# EAGLE design Solarbrain (EAGLE 6.2)
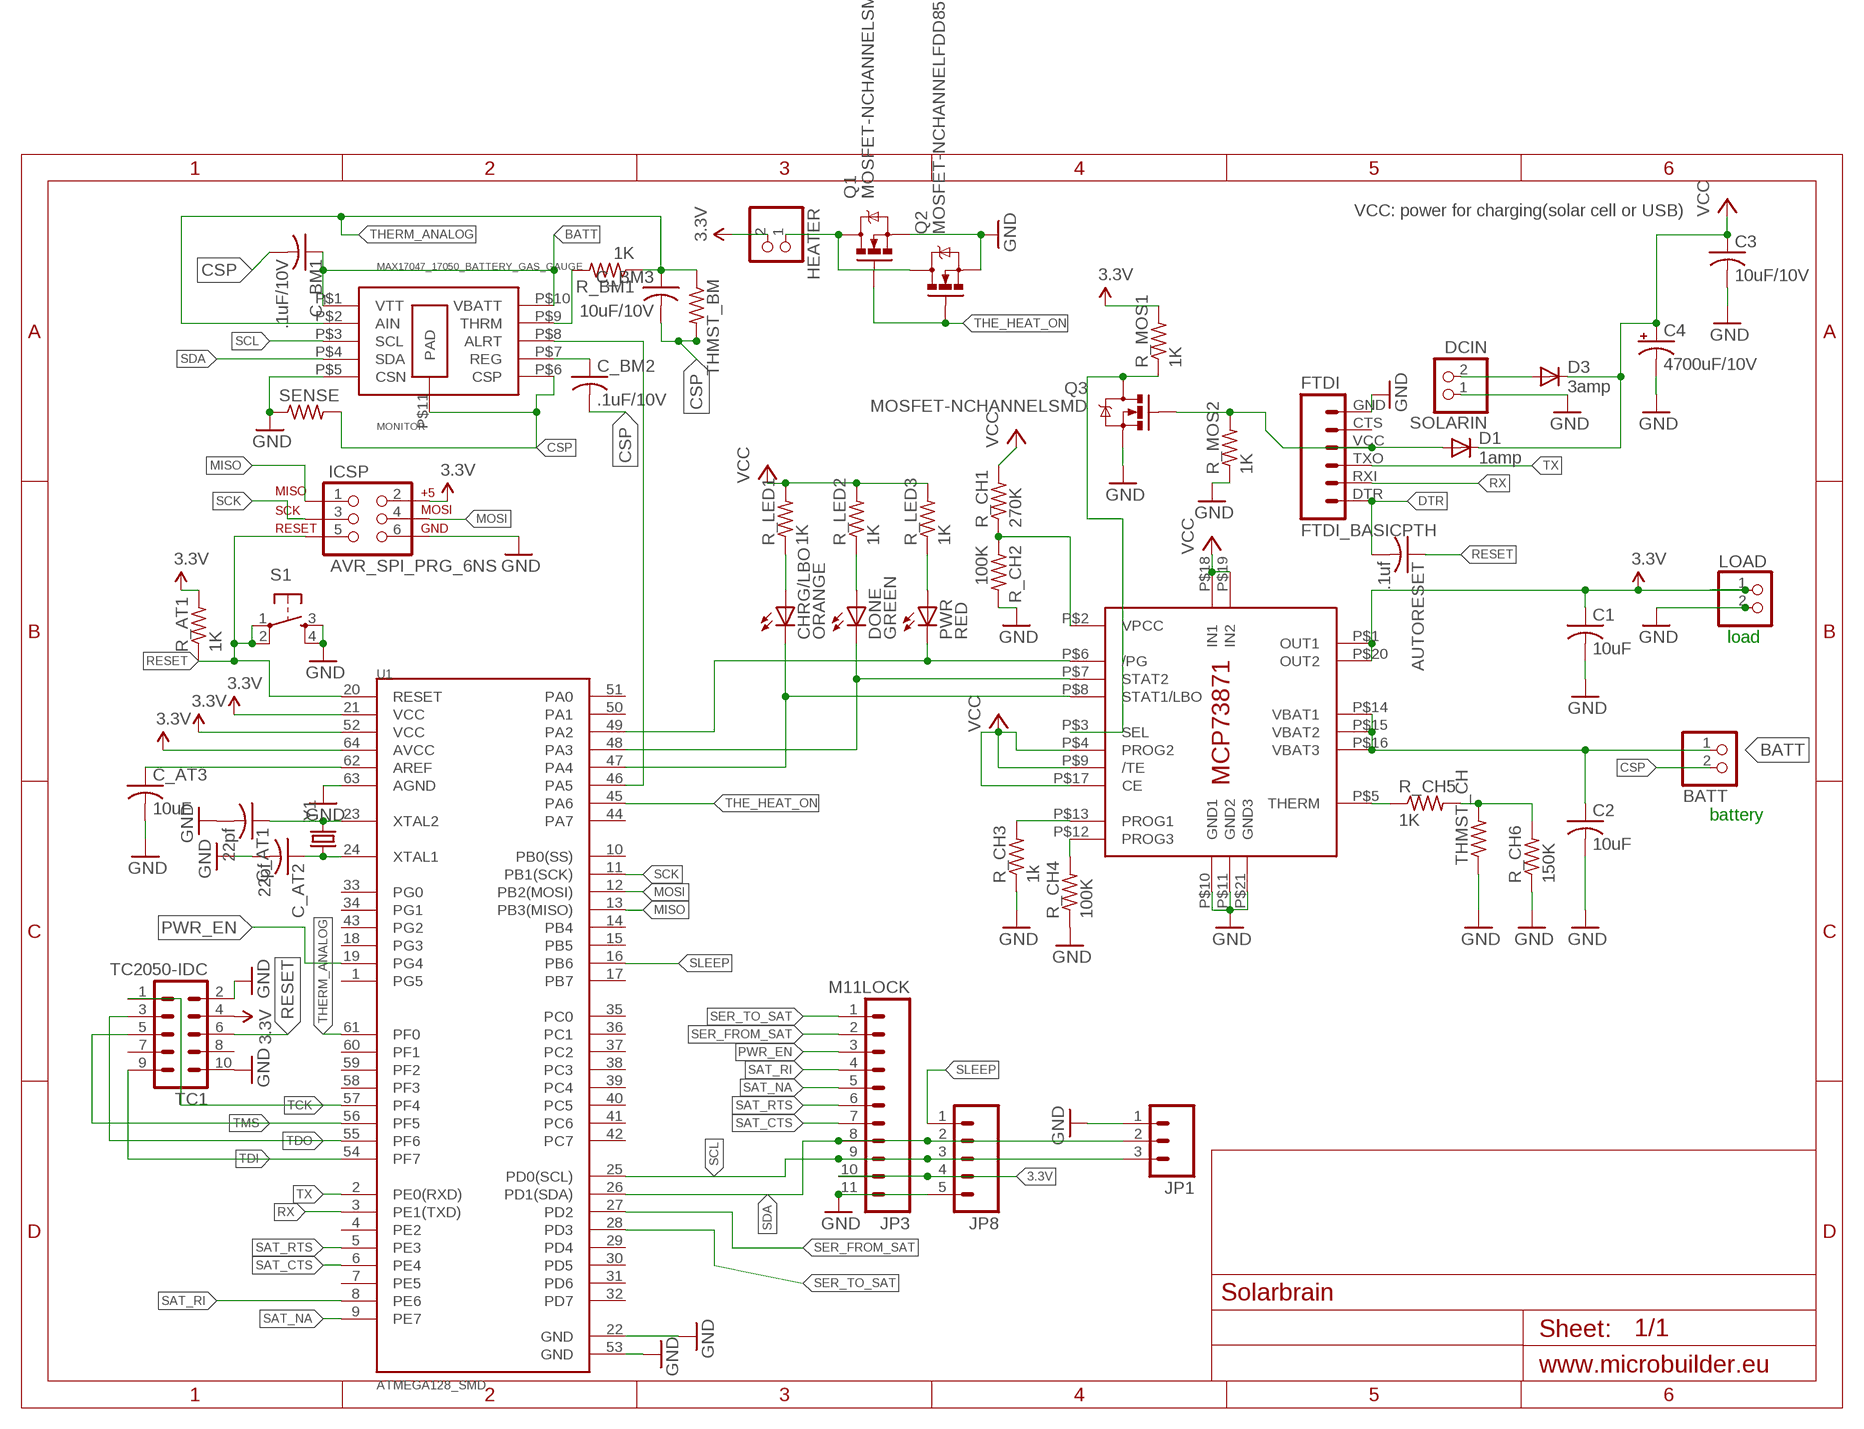
[diagram p0: schematic, sheet 1]

## Parts
AUTORESET  .1uf  C-USC0603  [C0603]
BATT  JST_2PIN-SMT-RA  [JST-PH-2-SMT-RA]
C1  10uF  C-USC0603  [C0603]
C2  10uF  C-USC0805K  [C0805K]
C3  10uF/10V  C-USC0603  [C0603]
C4  4700uF/10V  CPOL-USG  [PANASONIC_G]
C_AT1  22pf  C-USC0603K  [C0603K]
C_AT2  22pf  C-USC0603  [C0603]
C_AT3  10uF  C-USC0805K  [C0805K]
C_BM1  .1uF/10V  C-USC0603  [C0603]
C_BM2  .1uF/10V  C-USC0603  [C0603]
C_BM3  10uF/10V  C-USC0603  [C0603]
CHRG/LBO  ORANGE  LEDCHIP-LED0603  [CHIP-LED0603]
D1  1amp  DIODESMA  [SMA-DIODE]
D3  3amp  DIODESMA  [SMA-DIODE]
DONE  GREEN  LEDCHIP-LED0603  [CHIP-LED0603]
FTDI  FTDI_BASICPTH  [FTDI_BASIC]
HEATER  HEADER-1X2ROUND  [1X02_ROUND]
IC1  MCP73871  [QFN20_4MM]
ICSP  AVR_SPI_PRG_6NS  [2X3-NS]
JP1  M03PTH  [1X03]
JP3  M11LOCK  [1X11_LOCK]
JP8  M05LOCK  [1X05_LOCK]
LOAD  HEADER-1X2ROUND  [1X02_ROUND]
MONITOR  MAX17047_17050_BATTERY_GAS_GAUGE  [TDFN_10_3X3MM]
PWR  RED  LEDCHIP-LED0603  [CHIP-LED0603]
Q1  MOSFET-NCHANNELSMD  [SOT23-3]
Q2  MOSFET-NCHANNELFDD8580  [DPAK]
Q3  MOSFET-NCHANNELSMD  [SOT23-3]
R_AT1  1K  R-US_R0603  [R0603]
R_BM1  1K  R-US_R0603  [R0603]
R_CH1  270K  R-US_R0603  [R0603]
R_CH2  100K  R-US_R0603  [R0603]
R_CH3  1k  R-US_R0603  [R0603]
R_CH4  100K  R-US_R0603  [R0603]
R_CH5  1K  R-US_R0603  [R0603]
R_CH6  150K  R-US_R0603  [R0603]
R_LED1  1K  R-US_R0603  [R0603]
R_LED2  1K  R-US_R0603  [R0603]
R_LED3  1K  R-US_R0603  [R0603]
R_MOS1  1K  R-US_R0603  [R0603]
R_MOS2  1K  R-US_R0603  [R0603]
S1  TAC_SWITCHSMD  [TACTILE_SWITCH_SMD]
SENSE  R-US_R3225  [R3225]
SOLARIN  DCIN  HEADER-1X2ROUND  [1X02_ROUND]
TC1  TC2050-IDC  [TC2050-IDC]
THMST_BM  R-US_R0603  [R0603]
THMST_CH  R-US_R0603  [R0603]
U1  ATMEGA128_SMD  [TQFP64]
Y1  CRYSTAL5X3  [CRYSTAL-SMD-5X3]

## Nets
3.3V [power]: C1.1 HEATER.2 IC1.P$1(OUT1) IC1.P$20(OUT2) ICSP.2 JP3.10 JP8.4 LOAD.1 R_AT1.2 R_MOS1.2 TC1.4 U1.21(VCC) U1.52(VCC) U1.64(AVCC)
#PG: IC1.P$6(/PG) PWR.C U1.49(PA2)
BATT [power]: BATT.1 C2.1 C_BM1.1 IC1.P$14(VBAT1) IC1.P$15(VBAT2) IC1.P$16(VBAT3) MONITOR.P$1(VTT) MONITOR.P$10(VBATT)
CSP [power]: BATT.2 C_BM1.2 C_BM2.2 C_BM3.2 MONITOR.P$6(CSP) MONITOR.P$11(PAD) SENSE.2 THMST_BM.2
DTR [power]: AUTORESET.2 FTDI.DTR
GND [power]: C1.2 C2.2 C3.2 C4.- C_AT1.2 C_AT2.2 C_AT3.2 FTDI.GND IC1.P$10(GND1) IC1.P$11(GND2) IC1.P$21(GND3) ICSP.6 JP1.1 JP3.11 JP8.5 LOAD.2 MONITOR.P$5(CSN) Q1.2(S) Q2.3(S) Q3.2(S) R_CH2.2 R_CH3.1 R_CH4.1 R_CH6.1 R_MOS2.1 S1.3 S1.4 SENSE.1 SOLARIN.1 TC1.2 TC1.10 THMST_CH.1 U1.22(GND) U1.53(GND) U1.63(AGND)
MISO [power]: ICSP.1 U1.13(PB3(MISO))
MOSI [power]: ICSP.4 U1.12(PB2(MOSI))
N$2 [power]: D1.A FTDI.VCC Q3.1(G) R_MOS2.2
N$3 [power]: C_AT1.1 U1.23(XTAL2) Y1.3
N$5: IC1.P$5(THERM) R_CH5.1
N$8: R_CH5.2 R_CH6.2 THMST_CH.2
N$9 [power]: C_AT2.1 U1.24(XTAL1) Y1.1
N$12: CHRG/LBO.A R_LED1.1
N$13: DONE.A R_LED2.1
N$14: PWR.A R_LED3.1
N$19 [power]: MONITOR.P$8(ALRT) U1.46(PA5)
N$20 [power]: C_AT3.1 U1.62(AREF)
N$21 [power]: HEATER.1 Q1.3(D) Q2.4(D)
N$22 [power]: MONITOR.P$9(THRM) R_BM1.2
N$24 [power]: D3.A SOLARIN.2
N$26 [power]: C_BM2.1 MONITOR.P$7(REG)
PROG1: IC1.P$13(PROG1) R_CH3.2
PROG3: IC1.P$12(PROG3) R_CH4.2
PWR_EN: JP3.3 U1.19(PG4)
RESET [power]: AUTORESET.1 ICSP.5 R_AT1.1 S1.1 S1.2 TC1.6 U1.20(RESET)
RX [power]: FTDI.RXI U1.3(PE1(TXD))
SAT_CTS: JP3.7 U1.6(PE4)
SAT_NA [power]: JP3.5 U1.9(PE7)
SAT_RI [power]: JP3.4 U1.8(PE6)
SAT_RTS [power]: JP3.6 U1.5(PE3)
SCK [power]: ICSP.3 U1.11(PB1(SCK))
SCL [power]: JP1.3 JP3.9 JP8.3 MONITOR.P$3(SCL) U1.25(PD0(SCL))
SDA [power]: JP1.2 JP3.8 JP8.2 MONITOR.P$4(SDA) U1.26(PD1(SDA))
SEL [power]: IC1.P$3(SEL) Q3.3(D) R_MOS1.1
SER_FROM_SAT: JP3.2 U1.27(PD2)
SER_TO_SAT: JP3.1 U1.28(PD3)
SLEEP: JP8.1 U1.16(PB6)
STAT1: CHRG/LBO.C IC1.P$8(STAT1/LBO) U1.47(PA4)
STAT2: DONE.C IC1.P$7(STAT2) U1.48(PA3)
TCK [power]: TC1.1 U1.57(PF4)
TDI [power]: TC1.9 U1.54(PF7)
TDO [power]: TC1.3 U1.55(PF6)
THE_HEAT_ON [power]: Q1.1(G) Q2.1(G) U1.45(PA6)
THERM_ANALOG [power]: C_BM3.1 MONITOR.P$2(AIN) R_BM1.1 THMST_BM.1 U1.61(PF0)
TMS [power]: TC1.5 U1.56(PF5)
TX [power]: FTDI.TXO U1.2(PE0(RXD))
VCC [power]: C3.1 C4.+ D1.C D3.C IC1.P$4(PROG2) IC1.P$9(/TE) IC1.P$17(CE) IC1.P$18(IN1) IC1.P$19(IN2) R_CH1.2 R_LED1.2 R_LED2.2 R_LED3.2
VPCC: IC1.P$2(VPCC) R_CH1.1 R_CH2.1
Unconnected: FTDI.CTS TC1.7 TC1.8 U1.1(PG5) U1.4(PE2) U1.7(PE5) U1.10(PB0(SS)) U1.14(PB4) U1.15(PB5) U1.17(PB7) U1.18(PG3) U1.29(PD4) U1.30(PD5) U1.31(PD6) U1.32(PD7) U1.33(PG0) U1.34(PG1) U1.35(PC0) U1.36(PC1) U1.37(PC2) U1.38(PC3) U1.39(PC4) U1.40(PC5) U1.41(PC6) U1.42(PC7) U1.43(PG2) U1.44(PA7) U1.50(PA1) U1.51(PA0) U1.58(PF3) U1.59(PF2) U1.60(PF1)

## Notes on the sheet
- VCC: power for charging(solar cell or USB)
- load
- battery

## Library data of the parts
AUTORESET C1-C3 C_AT1-C_AT3 C_BM1-C_BM3 = adafruit:C-US: CAPACITOR, American symbol
BATT = adafruit:JST_2PIN: JST 2-Pin Connectors of various flavors SMT-RA (S2B-PH-SM4) 4UConnector #17311 SMT (B2B-PH-SM4) THM-RA (S2B-PH) THM (B2B-PH)
C4 = adafruit:CPOL-US: POLARIZED CAPACITOR, American symbol
CHRG/LBO DONE PWR = adafruit:LED: LED OSRAM: - CHIPLED LG R971, LG N971, LY N971, LG Q971, LY Q971, LO R971, LY R971 LH N974, LH R974 LS Q976, LO Q976, LY Q976 LO Q996 - Hyper CHIPLED LW Q18S LB Q993, LB Q99A, LB R99A - SideLED LS A670, LO A670, LY A670, LG A670, LP A670 LB A673, LV A673, LT A673, LW A673 LH A674 LY A675 LS A676, LA A676, LO A676, LY A676, LW A676 LS A679, LY A679, LG A679 - Hyper Micro SIDELED® LS Y876, LA Y876, LO Y876, LY Y876 LT Y87S - SmartLED LW L88C, LW L88S LB L89C, LB L89S, LG L890 LS L89K, LO L89K, LY L89K LS L896, LA L896, LO L896, LY L896 - TOPLED LS T670, LO T670, LY T670, LG T670, LP T670 LSG T670, LSP T670, LSY T670, LOP T670, LYG T670 LG T671, LOG T671, LSG T671 LB T673, LV T673, LT T673, LW T673 LH T674 LS T676, LA T676, LO T676, LY T676, LB T676, LH T676, LSB T676, LW T676 LB T67C, LV T67C, LT T67C, LS T67K, LO T67K, LY T67K, LW E67C LS E67B, LA E67B, LO E67B, LY E67B, LB E67C, LV E67C, LT E67C LW T67C LS T679, LY T679, LG T679 LS T770, LO T770, LY T770, LG T770, LP T770 LB T773, LV T773, LT T773, LW T773 LH T774 LS E675, LA E675, LY E675, LS T675 LS T776, LA T776, LO T776, LY T776, LB T776 LHGB T686 LT T68C, LB T68C - Hyper Mini TOPLED® LB M676 - Mini TOPLED Santana® LG M470 LS M47K, LO M47K, LY M47K Source: http://www.osram.convergy.de/
D1 D3 = SparkFun2011:DIODE: Diode These are standard reverse protection diodes and small signal diodes. SMA package can handle up to about 1A. SOD-323 can handle about 200mA. What the SOD-323 package when ordering, there are some mfgs out there that are 5-pin packages.
FTDI = SparkFun2011:FTDI_BASIC: FTDI Basic: 3.3V and 5V
HEATER LOAD SOLARIN = microbuilder:HEADER-1X2: PIN HEADER
IC1 = adafruit:MCP73871
ICSP = SparkFun2011:AVR_SPI_PRG_6: AVR ISP 6 Pin This is the reduced ISP connector for AVR programming. Common on Arduino. This footprint will take up less PCB space and can be used with a 10-pin to 6-pin adapter such as SKU: BOB-08508
JP1 = SparkFun2011:M03: Header 3 Standard 3-pin 0.1" header. Use with straight break away headers (SKU : PRT-00116), right angle break away headers (PRT-00553), swiss pins (PRT-00743), machine pins (PRT-00117), and female headers (PRT-00115). Molex polarized connector foot print use with SKU : PRT-08232 with associated crimp pins and housings.
JP3 = SparkFun2011:M11: Header 11 Standard 11-pin 0.1" header. Use with straight break away headers (SKU : PRT-00116), right angle break away headers (PRT-00553), swiss pins (PRT-00743), machine pins (PRT-00117), and female headers (PRT-00115).
JP8 = SparkFun2011:M05: Header 5 Standard 5-pin 0.1" header. Use with straight break away headers (SKU : PRT-00116), right angle break away headers (PRT-00553), swiss pins (PRT-00743), machine pins (PRT-00117), and female headers (PRT-00115). Molex polarized connector foot print use with SKU : PRT-08230 with associated crimp pins and housings.
MONITOR = RaphaelBigLibrary:MAX17047_17050_BATTERY_GAS_GAUGE
Q1-Q3 = SparkFun2011:MOSFET-NCHANNEL
R_AT1 R_BM1 R_CH1-R_CH6 R_LED1-R_LED3 R_MOS1 R_MOS2 = adafruit:R-US_: RESISTOR, American symbol
S1 = SparkFun2011:TAC_SWITCH: Momentary Switch Button commonly used for reset or general input. Spark Fun Electronics SKU : COM-00097
SENSE THMST_BM THMST_CH = rcl:R-US_: RESISTOR, American symbol
TC1 = TagConnect:TC2050-IDC: Tag-Connect In Circuit Programming & Debug Cable 10 Pin http://www.tag-connect.com
U1 = SparkFun2011:ATMEGA128: ATmega128/128L/1281/2561. Note: The ATmega128 pin 1 is PEN and the ATmega256/1281 pin 1 is PG5.
Y1 = SparkFun2011:CRYSTAL: Crystals Various standard crystals. Proven footprints. Spark Fun Electronics SKU : COM-00534

## Net classes
0 default: width 0.178 mm, drill 0.381 mm, clearance 0.178 mm
1 power: width 0.178 mm, drill 0.381 mm, clearance 0.178 mm

## Board
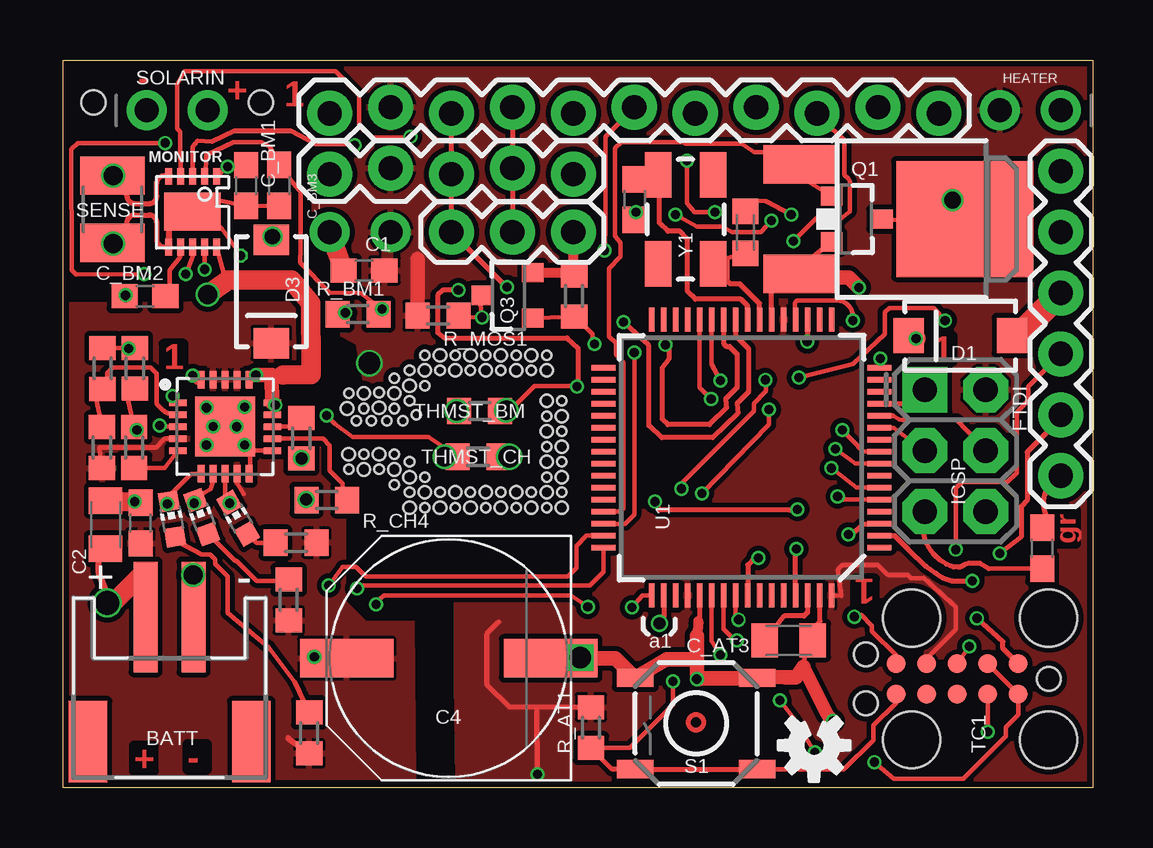
[diagram p1: board, top side]
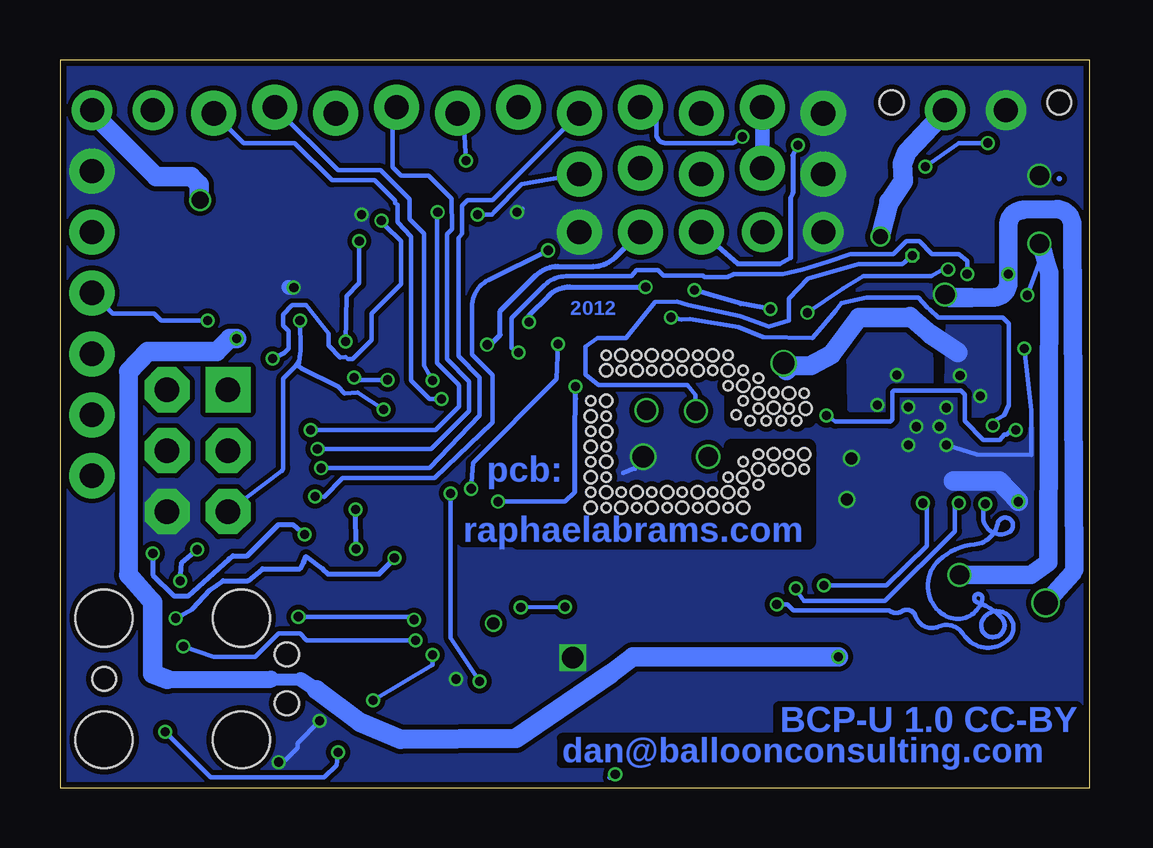
[diagram p2: board, bottom side, seen from below]

Size 42.93 x 30.35 mm. Coordinates in mm from the lower left corner, seen from the top.
Outline: 0,0 0,30.35 42.93,30.35 42.93,0 0,0
Copper layers (1*16): Top 0.035mm / dielectric 1.5mm / Bottom 0.035mm
Design rules: minimum track width 5mil, minimum drill 15mil, track to track 8mil, track to pad 8mil, pad to pad 8mil, via to via 8mil, smd to smd 0mil, copper to edge 10mil, drill to drill 7mil, minimum pad ring 8mil, minimum via ring 4mil, stop-mask expansion 3mil, vias tented up to drill 20mil, thermal gap 5mil
Holes 0.38 mm at 19.53,12.33 20.16,11.69 18.89,11.69 18.26,12.33 16.99,12.33 15.72,12.33 15.08,11.69 17.62,11.69 20.16,12.96 20.16,14.23 14.45,12.33 20.16,15.5 20.16,18.04 18.89,18.04 18.26,17.41 16.35,11.69 17.62,18.04 16.35,18.04 15.08,18.04 14.45,17.41 14.45,16.14 14.45,13.6 15.72,17.41 16.99,17.41 19.53,17.41 13.81,15.82 12.54,15.82 13.81,13.92 12.54,13.92 13.81,17.09 13.81,12.65 20.8,16.14 20.8,14.87 20.8,13.6 20.8,12.33 13.18,16.49 11.91,16.46 11.91,13.28 13.18,13.28 15.08,12.96 15.08,16.77 14.16,15.31 14.73,15.57 12.22,15.31 12.86,15.31 13.49,15.31
Holes 0.51 mm at 17.62,12.33 16.35,12.33 15.08,12.33 18.89,12.33 18.26,11.69 16.99,11.69 20.16,12.33 14.45,11.69 14.45,12.96 15.72,11.69 20.16,13.6 20.16,16.14 19.53,18.04 20.16,17.41 18.89,17.41 18.26,18.04 17.62,17.41 19.53,11.69 16.35,17.41 15.72,18.04 16.99,18.04 15.08,17.41 14.45,16.77 13.81,16.46 13.81,13.28 13.18,15.85 13.18,13.92 20.16,14.87 20.8,15.5 20.8,14.23 20.8,12.96 20.8,11.69 11.84,15.82 11.91,13.92 12.54,16.46 12.54,13.28
Holes 1 mm at 1.27,28.57 8.26,28.57
tRestrict: 1 lines
bRestrict: area 11.7,10.3 to 23.8,19.5

### Footprints (pad centres in the part's own frame; a part is rotated, then mirrored left to right if it is on the bottom)
C0603 = smd 1.1 x 1: 1 -0.85,0; 2 0.85,0
JST-PH-2-SMT-RA = smd 1 x 4.6: 1 1,-3.7; 2 -1,-3.7 | smd 1.6 x 3.4: NC1 -3.4,1.5; NC2 3.4,1.5
C0805K = smd 1.1 x 1.4: 1 -1,0; 2 1,0
PANASONIC_G = smd 3.9 x 1.6: + 4.25,0; - -4.25,0
C0603K = smd 1.05 x 1.08: 1 -0.875,0; 2 0.875,0
CHIP-LED0603 = smd 0.8 x 0.8: A 0,-0.75; C 0,0.75
SMA-DIODE = smd 1.27 x 1.47: A -2.15,0; C 2.15,0
FTDI_BASIC = drill 1.016 pad 1.88: CTS 10.16,0; DTR 0,0; GND 12.7,0; RXI 2.54,0; TXO 5.08,0; VCC 7.62,0
1X02_ROUND = drill 1 pad 1.676: 1 -1.27,0; 2 1.27,0
QFN20_4MM = smd 0.73 x 0.28: P$1 -1.965,1; P$2 -1.965,0.5; P$3 -1.965,0; P$4 -1.965,-0.5; P$5 -1.965,-1; P$11 1.965,-1; P$12 1.965,-0.5; P$13 1.965,0; P$14 1.965,0.5; P$15 1.965,1 | smd 0.28 x 0.73: P$6 -1,-1.965; P$7 -0.5,-1.965; P$8 0,-1.965; P$9 0.5,-1.965; P$10 1,-1.965; P$16 1,1.965; P$17 0.5,1.965; P$18 0,1.965; P$19 -0.5,1.965; P$20 -1,1.965 | smd 2.5 x 2.5: P$21 0,0
2X3-NS = drill 1.016 pad 1.88 square: 1 -2.54,-1.27 | drill 1.016 pad 1.88 octagon: 2 -2.54,1.27; 3 0,-1.27; 4 0,1.27; 5 2.54,-1.27; 6 2.54,1.27
1X03 = drill 1.016 pad 1.88: 1 0,0; 2 2.54,0; 3 5.08,0
1X11_LOCK = drill 1.016 pad 1.88: 1 0,0.127; 2 2.54,-0.127; 3 5.08,0.127; 4 7.62,-0.127; 5 10.16,0.127; 6 12.7,-0.127; 7 15.24,0.127; 8 17.78,-0.127; 9 20.32,0.127; 10 22.86,-0.127; 11 25.4,0.127
1X05_LOCK = drill 1.016 pad 1.88: 1 0,0.127; 2 2.54,-0.127; 3 5.08,0.127; 4 7.62,-0.127; 5 10.16,0.127
TDFN_10_3X3MM = smd 0.7 x 0.295: P$1 -1.5,1; P$2 -1.5,0.5; P$3 -1.5,0; P$4 -1.5,-0.5; P$5 -1.5,-1; P$6 1.45,-1; P$7 1.45,-0.5; P$8 1.45,0; P$9 1.45,0.5; P$10 1.45,1 | smd 1.58 x 2.35: P$11 -0.025,0
SOT23-3 = smd 0.8 x 0.9: 1 -0.95,-1; 2 0.95,-1; 3 0,1.1
DPAK = smd 1.6 x 3: 1 -2.28,-5.31; 3 2.28,-5.31 | smd 4.826 x 5.715: 4 0,1.588
R0603 = smd 1 x 1.1: 1 -0.85,0; 2 0.85,0
TACTILE_SWITCH_SMD = smd 1.524 x 0.762: 1 -2.54,1.905; 2 2.54,1.905; 3 -2.54,-1.905; 4 2.54,-1.905
R3225 = smd 1.6 x 2.7: 1 -1.4,0; 2 1.4,0
TC2050-IDC = smd 0.787 x 0.787: 1 -2.54,-0.635; 2 -1.27,-0.635; 3 0,-0.635; 4 1.27,-0.635; 5 2.54,-0.635; 6 2.54,0.635; 7 1.27,0.635; 8 0,0.635; 9 -1.27,0.635; 10 -2.54,0.635 | hole 0.991: -3.81,0; 3.81,1.016; 3.81,-1.016 | hole 2.375: -3.81,2.54; -3.81,-2.54; 1.905,2.54; 1.905,-2.54
TQFP64 = smd 0.22 x 1: 1 -3.75,-5.75; 2 -3.25,-5.75; 3 -2.75,-5.75; 4 -2.25,-5.75; 5 -1.75,-5.75; 6 -1.25,-5.75; 7 -0.75,-5.75; 8 -0.25,-5.75; 9 0.25,-5.75; 10 0.75,-5.75; 11 1.25,-5.75; 12 1.75,-5.75; 13 2.25,-5.75; 14 2.75,-5.75; 15 3.25,-5.75; 16 3.75,-5.75; 33 3.75,5.75; 34 3.25,5.75; 35 2.75,5.75; 36 2.25,5.75; 37 1.75,5.75; 38 1.25,5.75; 39 0.75,5.75; 40 0.25,5.75; 41 -0.25,5.75; 42 -0.75,5.75; 43 -1.25,5.75; 44 -1.75,5.75; 45 -2.25,5.75; 46 -2.75,5.75; 47 -3.25,5.75; 48 -3.75,5.75 | smd 1 x 0.22: 17 5.75,-3.75; 18 5.75,-3.25; 19 5.75,-2.75; 20 5.75,-2.25; 21 5.75,-1.75; 22 5.75,-1.25; 23 5.75,-0.75; 24 5.75,-0.25; 25 5.75,0.25; 26 5.75,0.75; 27 5.75,1.25; 28 5.75,1.75; 29 5.75,2.25; 30 5.75,2.75; 31 5.75,3.25; 32 5.75,3.75; 49 -5.75,3.75; 50 -5.75,3.25; 51 -5.75,2.75; 52 -5.75,2.25; 53 -5.75,1.75; 54 -5.75,1.25; 55 -5.75,0.75; 56 -5.75,0.25; 57 -5.75,-0.25; 58 -5.75,-0.75; 59 -5.75,-1.25; 60 -5.75,-1.75; 61 -5.75,-2.25; 62 -5.75,-2.75; 63 -5.75,-3.25; 64 -5.75,-3.75
CRYSTAL-SMD-5X3 = smd 1.9 x 1.1: 1 -1.85,-1.15; 2 1.85,-1.15; 3 1.85,1.15; 4 -1.85,1.15

### Placement (x,y rotation side)
AUTORESET  40.81,9.99 90 top
BATT  4.45,3.43 180 top
C1  12.55,21.58 180 top
C2  1.78,10.98 90 top
C3  3.23,11.05 90 top
C4  16.08,5.41 180 top
C_AT1  28.45,23.17 90 top
C_AT2  23.83,24.53 270 top
C_AT3  30.25,6.15 0 top
C_BM1  7.63,25.12 270 top
C_BM2  3.42,20.5 180 top
C_BM3  9.01,25.12 270 top
CHRG/LBO  7.3,11.24 30 top
D1  37.4,18.86 180 top
D3  8.68,20.69 270 top
DONE  5.78,11.29 20 top
FTDI  41.59,13.02 90 top
HEATER  40.32,28.26 180 top
IC1  6.76,15.06 0 top
ICSP  37.19,14.06 270 top
JP1  21.27,23.18 180 top
JP3  36.51,28.26 180 top
JP8  21.27,25.72 180 top
LOAD  12.38,23.18 180 top
MONITOR  5.4,24 270 top
PWR  4.54,11.21 10 top
Q1  33.04,23.72 270 top
Q2  36,23.72 270 top
Q3  18.57,20.54 90 top
R_AT1  22.01,2.52 90 top
R_BM1  12.29,19.75 180 top
R_CH1  1.62,14.2 270 top
R_CH2  1.65,17.49 90 top
R_CH3  9.94,14.58 90 top
R_CH4  10.99,12 0 top
R_CH5  2.97,14.19 90 top
R_CH6  3,17.5 270 top
R_LED1  9.71,10.23 0 top
R_LED2  9.41,7.84 270 top
R_LED3  10.26,2.3 270 top
R_MOS1  15.63,19.7 180 top
R_MOS2  21.3,20.51 270 top
S1  26.39,2.69 180 top
SENSE  2.06,24.13 270 top
SOLARIN  4.76,28.26 0 top
TC1  37.28,4.55 180 top
THMST_BM  17.37,15.72 180 top
THMST_CH  17.3,13.81 180 top
U1  28.29,13.77 90 top
U$1  [OSHW-LOGO-S]  31.31,1.78 180 top
Y1  25.95,23.71 270 top

### Tracks (layer width: path | path; a pad name or v marks a point on that pad's centre or on a via)
3.3V  (via drill 0.38, 0.9)
  Top 0.178: TC1.4 36.01,5.4 37.21,6.6 37.21,7.56 35.88,8.76 35.37,8.73 35.21,8.89 34.38,8.89 33.97,9.3 32.48,9.3 32.29,9.11 32.45,8.02 U1.64
  Top 0.203: R_AT1.2 19.75,3.37 | 19.75,3.37 18.6,3.37 17.68,4.29 17.68,6.45 18.16,6.92 | v19.78,0.57 19.75,3.37
  Top 0.305: IC1.P$20 5.6,16.97 v5.41,17.19 | IC1.P$1 4.66,16.09 v4.57,16.35
  Top 0.61: R_MOS1.2 14.78,22.05
  Top 0.813: R_MOS1.2 14.71,19.79
  Bottom 0.178: 13.68,28.42 JP3.10
  Bottom 0.203: 20,0.45 v19.78,0.57
  Bottom 0.406: 13.68,28.42 13.72,28.38
  Bottom 0.61: JP3.10 JP8.4
  Bottom 0.813: v12.76,17.72 12.64,17.4 12.45,17.59 11.62,17.62 10.76,18.07 9.62,19.62 7.49,19.62 7.49,19.65 6.64,18.92 5.49,18.16
  pour Bottom (no thermals): 0.73,21.52 5.88,21.44 5.97,16.81 5.18,16.81 4.94,16.49 4.94,15.54 0.71,15.53 0.71,17.43
  pour Top (isolate 0.178): 17.75,0.29 16.45,0.25 16.38,4.41 16.38,9.65 17.75,11.02 20.95,11.02 21.81,11.87 21.81,17.62 20.89,18.54 15.4,18.54 13.68,16.76 12.64,16.67 12.29,18.54 11.46,18.99 12.38,19.43 10.38,22.64 10.7,30.29 42.83,30.29 42.89,30.23 42.89,0.19 42.77,0.06 18.48,0.06 18.26,0.29
#PG  (via drill 0.38)
  Top 0.178: IC1.P$6 5.35,13.1 4.51,12.26 4.51,11.95 PWR.C 4.46,11.94 v4.35,11.84 | U1.49 24.15,8.02 v23.72,7.53 | v21.88,7.56 21.18,8.03 13.38,8.02 13.24,7.91 v13.05,7.65
  Bottom 0.178: v23.72,7.53 v21.88,7.56 | v13.05,7.65 12.61,7.65 12.35,7.4 8.35,7.4 arc-77 7.84,7.37 arc107 7.27,7.18 arc-95 6.29,6.73 arc81 5.27,6.41 arc-104 3.37,6.22 arc-198 4.48,6.99 arc-249 3.68,7.11 arc-29 4.7,7.75 arc265 4.48,7.87 arc109 6.06,7.21 arc106 6.29,9.49 arc37 4.79,10.16 arc-73 3.84,11.02 arc229 3.37,10.67 arc119 4.45,11.3 4.45,11.95 4.47,11.95 v4.35,11.84
BATT  (via drill 0.38, 0.8, 1)
  Top 0.178: v8.85,15.97 IC1.P$14 | 6.44,25.5 MONITOR.P$1 v6.86,25.91 C_BM1.1 | v4.25,26.89 0.6,26.89 0.35,26.64 0.37,21.59 0.54,21.4 v3.39,21.43 | MONITOR.P$10 6.79,21.08 v6.03,20.57 | 7.88,17.06 7.79,17.06 IC1.P$16 | 9.18,17.21 8.77,17.21 8.7,17.14
  Top 0.254: C2.1 1.42,9.93 1.39,10.08 1.49,10.06 1.49,8.98 1.77,8.26 v1.84,7.72
  Top 0.305: 7.88,17.06 v8.04,17.22
  Top 0.61: IC1.P$15 8.7,17.14 8.7,17.21 v8.04,17.22
  Top 0.762: BATT.1 3.41,9.03 2.24,7.86 arc9 1.85,7.57 v1.84,7.72
  Top 0.813: 9.18,17.21 10.35,17.24 10.35,17.53 10.32,20.23 9.53,21.18 6.89,21.18 v6.03,20.57
  Bottom 0.178: v6.86,25.91 5.46,26.89 v4.25,26.89 | v6.03,20.57 5.82,20.46
  Bottom 0.762: v1.84,7.72 0.73,8.96 0.64,9.11 0.73,23.42 arc-90 1.36,24.14 2.76,24.1 arc-90 3.39,23.47 v3.39,21.43 3.39,21.09 arc90 3.99,20.46 4.95,20.46
  Bottom 0.813: 4.95,20.46 5.82,20.46
  pour Bottom (no thermals): 6.6,16.81 6.64,21.44 9.18,21.44 arc-45 9.63,21.26 9.93,21.34 arc-45 10.11,20.89 10.01,15.78 8.43,15.78 8.43,16.81 7.08,16.81
CSP  (via drill 0.38, 0.8)
  Top 0.178: 16.41,15.78 v16.41,15.72 THMST_BM.2 | v7.4,22.19 7.4,22.23 6.64,23.3 6,23.91 6.25,23.65 | 6.25,23.65 6.37,23.83 6.45,24.51 C_BM1.2 C_BM3.2 | 6.25,23.65 5.77,23.65 MONITOR.P$11 | 2.73,20.57 v2.6,20.54
  Top 0.203: SENSE.2 2.67,23.57 arc-90 2.98,23.89 3.59,23.89 arc-90 3.9,23.57 3.9,22.86 arc91 4.26,22.55 MONITOR.P$6 | C_BM2.2 2.73,20.57
  Top 0.254: BATT.2 5.44,7.14 5.44,8.87 5.41,8.89 v5.43,8.89 | MONITOR.P$11 4.4,24.03 MONITOR.P$6
  Top 0.61: 2.71,20.41 C_BM2.2
  Top 0.762: v2.1,22.7 SENSE.2
  Bottom 0.178: v7.4,22.19 7.81,21.84 9.65,21.84 11.75,21.24 12.54,20.41 12.54,19.49 13.37,19.24 14.57,19.68 16.73,20.13 17.21,20.29 18.13,20.26 19.34,18.76 20.51,18.76 21.02,18.41 21.02,17.24 20.48,16.8 16.76,16.8 16.45,16.38 16.45,15.75 v16.41,15.72 | v2.6,20.54 1.93,22.34
  Bottom 0.762: v5.43,8.89 2.46,8.89 1.73,9.4 1.7,21.48 arc-7 1.75,21.69 1.93,22.34 v2.1,22.7
DTR
  Top 0.203: AUTORESET.2 41,11.32 arc-90 FTDI.DTR
GND  (via drill 0.38, 0.5, 0.8, 0.9)
  Top 0.178: IC1.P$11 7.8,14.06 | 7.8,14.06 v7.57,14.3 | 7.8,14.06 7.8,13.14 IC1.P$10 | v9.94,13.75 R_CH3.1 | R_CH4.1 10.14,12.02 v10.13,12.03 | C_AT1.2 28.7,24.48 29.31,24.48 v30.35,23.91 | C_AT2.2 23.83,24.02 v23.88,24 | R_CH6.1 2.77,18.19 | 2.77,18.19 2.77,18.15 | 2.77,18.19 2.68,18.28 2.68,18.32 2.77,18.32 | R_CH2.2 1.55,18.35 R_CH6.1 | 31.56,6.95 31.25,6.65 C_AT3.2 30.93,5.54 30.86,5.05 | R_CH6.1 v2.73,18.32 | THMST_CH.1 v18.61,13.81 | v33.81,1.08 34.64,0.38 37.53,0.38 39.31,2.16 39.31,2.54 39.82,3.05 TC1.10 TC1.2
  Top 0.203: SENSE.1 2.67,24.69 arc90 2.98,24.37 3.62,24.37 arc90 3.9,24.69 3.9,25.21 arc-95 4.28,25.53 MONITOR.P$5 | v5.98,14.3 IC1.P$21 | U1.53 26.54,6.96 26.48,6.95 | 31.56,6.95 31.56,8 U1.63 | U1.22 29.54,20.7 Q2.3 30.17,21.28 Q1.2 | 23.85,23.95 C_AT2.2
  Top 0.3: IC1.P$21 7.1,15.6
  Top 0.406: 26.48,6.95 26.42,6.35 | Q3.2 21.3,21.49 R_MOS2.1 21.27,21.36 JP1.1
  Top 0.533: 30.86,5.05 31.84,3.08 v32.1,2.79
  Top 0.61: C4.- 23.03,5.41 S1.4 25.15,5.37 26.42,5.37 | 26.51,4.56 26.73,4.57 28.45,4.57 S1.3 29.01,4.63 30.1,4.6 30.54,4.6 30.86,5.05 | 26.42,6.35 26.42,5.37 | 26.42,5.37 26.42,4.75 26.51,4.56 | 30.17,21.28 32.76,21.28 v33.18,20.86 | 26.51,4.56 26.49,4.54 v26.42,4.54
  Top 0.762: SENSE.1 v2.1,25.53
  Top 0.813: C2.2 2.83,11.92 C3.2 2.9,11.9 v2.98,11.94 | C1.2 LOAD.2
  Bottom 0.178: v23.88,24 23.65,24.16 23.69,24.13 | v2.73,18.32 2.44,15.75 2.44,13.88 4.7,13.91 v5.98,14.3 | v18.61,13.81 18.95,13.3 | 18.95,13.34 19.46,13.14 | v33.81,1.08 33.81,0.89 33.02,1.68 33.02,1.87 v32.1,2.79
  Bottom 0.61: v33.18,20.86 33.37,20.86 33.4,20.89
  Bottom 0.762: v2.1,25.53 2.16,25.56
  Bottom 0.813: v2.98,11.94 2.98,11.97 3.78,12.79 5.68,12.79
  other vias: 5.98,15.86 7.57,15.89 7.23,15.06 6.26,15.08 21.56,5.43
  pour Bottom (isolate 0.203, no thermals): -0.54,0 -0.46,8.48 -0.53,14.96 5.36,15.05 5.49,15.05 5.52,16.29 8,16.29 8,15.48 10.92,15.48 11.02,21.92 7.86,21.92 -0.14,21.92 -0.1,30.18 42.68,30.18 42.78,0
MISO
  Top 0.203: U1.13 35.59,16.02 ICSP.1
MOSI
  Top 0.178: 34.58,15.52 34.86,15.37 34.99,15.34 37.26,15.34 ICSP.4
  Top 0.203: U1.12 34.58,15.52
N$1
  Top 0.203: 25.05,8 25.05,7.18 24.86,7.05
N$2  (via drill 0.38)
  Top 0.178: Q3.1 21.05,19.62 R_MOS2.2 21.33,19.66 22.07,18.92 22.07,18.61 v22.16,18.51 | v25.78,12.48 25.78,12.7 28.8,15.72 28.8,16.03 29.3,16.54 29.27,16.99 v29.27,17.02 | v30.67,17.11 32.92,17.68 34.26,18.92 34.26,19.84 34.45,20 36.29,20 v36.77,19.49
  Top 1.016: D1.A 39.81,18.86 FTDI.VCC
  Bottom 0.178: v22.16,18.51 22.23,17.05 25.72,13.56 v25.78,12.48 | v29.27,17.02 30.67,17.02 v30.67,17.11 | v36.77,19.49 38.7,19.49 38.99,19.78 40.73,19.78 FTDI.VCC
N$3
  Top 0.178: 27.69,21.82 27.69,22.09 C_AT1.1
  Top 0.203: U1.23 29.04,20.21 28.23,21.02 27.81,21.02 27.69,21.14 27.69,21.82 Y1.3 27.28,21.5
N$4  (via drill 0.51)
  other vias: 24.86,6.86
N$5
  Top 0.178: R_CH5.1 4.23,13.34 IC1.P$5
N$8  (via drill 0.38, 0.8)
  Top 0.178: R_CH6.2 2.71,16.14 R_CH5.2 2.96,15.04 v3.08,14.92 | v10.99,15.53 11.08,15.43 | 11.02,15.46 11.08,15.43 | 11.08,15.43 11.34,15.18 12.06,14.64 15.25,14.64 THMST_CH.2 16.45,13.75 16.45,13.37 16.41,13.37 v15.91,13.81
  Bottom 0.178: v3.08,14.92 3.27,14.92 3.46,14.73 3.56,14.73 3.75,14.51 4.45,14.51 5.21,15.3 5.21,16.41 5.37,16.57 8.16,16.57 8.22,16.51 8.22,15.37 8.32,15.27 10.6,15.27 v10.99,15.53
N$9
  Top 0.203: U1.24 28.54,20.1 28.26,20.38 26.35,20.38 26.04,20.7 26.04,22.89 | 26,22.89 26.04,22.89 | 26.04,22.89 25.72,23.21 25.21,23.21 24.86,23.56 24.86,24.61 Y1.1 25.02,25.56 24.96,25.5 24.32,25.5 C_AT2.1
N$12
  Top 0.178: CHRG/LBO.A 7.57,10.72 8.06,10.22 R_LED1.1
N$13
  Top 0.178: DONE.A 6.18,10.46 7.18,9.46 7.24,9.46 8.06,8.64 9.36,8.64 R_LED2.1
N$14
  Top 0.178: PWR.A 4.8,10.25 5.78,9.75 6.13,9.75 6.35,9.53 6.35,9.34 6.86,8.83 6.86,7.3 8.57,5.87 9.65,4.42 R_LED3.1
N$19  (via drill 0.38)
  Top 0.178: MONITOR.P$8 5.4,22.16 5.21,21.65 5.14,21.59 v5.11,21.43 | v23.81,18.16 23.81,11.4 23.43,11.02 U1.46
  Bottom 0.178: v5.11,21.43 5.11,21.97 5.46,22.26 6.57,22.26 7.11,22.8 7.65,22.8 8.19,22.26 9.97,22.26 10.89,21.94 11.97,21.62 12.79,21.43 14.83,21.43 15.11,21.3 16.07,21.3 16.13,21.37 17.78,21.37 18,21.59 18.89,21.59 19.11,21.34 21.83,21.34 arc-45 22.72,20.96 24.1,19.59 24.1,18.35 v23.81,18.16
N$20
  Top 0.203: U1.62 31.04,7.32 30.89,7.18 30.05,7.18 C_AT3.1
N$21  (via drill 0.7)
  Top 0.178: Q1.3 37.02,23.56
  Top 0.203: 37.02,23.56 Q2.4
  Top 0.813: v37.08,24.51 37.08,23.63 Q2.4
  Bottom 0.178: 41.59,28.16 HEATER.1
  Bottom 0.813: 41.59,28.16 38.92,25.5 37.47,25.5 37.12,25.15 37.12,24.54 v37.08,24.51
N$22  (via drill 0.38)
  Top 0.178: 11.81,19.81 11.63,19.64 R_BM1.2 v11.77,19.81 | MONITOR.P$9 5.9,21.77 v5.91,21.62
  Bottom 0.178: v5.91,21.62 5.91,21.75 6.6,21.34 9.43,21.34 10.29,20.83 v11.77,19.81
N$24  (via drill 0.64)
  Top 0.813: D3.A arc-90 8.86,22.79 v8.73,22.99
  Bottom 0.813: SOLARIN.2 6.1,28.29 arc-90 6.25,27.97 7.62,26.51 7.81,26.04 7.78,25.3 8.35,24.42 8.38,24.45 arc90 8.35,24.45 v8.73,22.99
N$26
  Top 0.178: C_BM2.1 4.37,20.37 4.45,20.86 4.45,21.59 4.89,22.13 4.9,22.38 MONITOR.P$7
PROG1
  Top 0.178: IC1.P$13 9.57,15.06 R_CH3.2
PROG3
  Top 0.178: IC1.P$12 10.84,14.56 11.11,14.29 11.11,13.24 11.65,12.7 11.65,12.19 R_CH4.2
PWR_EN  (via drill 0.38)
  Top 0.178: JP3.3 31.43,28.07 32.58,27.02 32.58,25.56 32.73,25.4 32.8,25.3 32.8,24.04 32.45,23.75 31.4,23.75 v30.45,22.8 | 31.02,19.46 31.05,19.05 v31.02,18.61 U1.19
  Bottom 0.178: v30.45,22.8 30.45,21.05 30.99,20.51 v31.02,18.61
RESET  (via drill 0.38)
  Top 0.178: S1.1 32.55,0.79 33.78,1.98 33.78,2.6 34.74,3.56 TC1.6 | v32.92,19.49 32.92,19.65 arc90 32.29,20.32 30.64,20.32 arc90 30.51,20.19 30.51,19.55 arc90 U1.20 | v25.43,4.45 25.42,3.9 25.43,3.46 23.64,1.67 R_AT1.1 22.89,0.79 | v26.64,12.29 29.43,15.14 v29.43,15.78
  Top 0.203: S1.1 S1.2 22.89,0.79 | AUTORESET.1 38.58,9.14 arc45 38.58,9.14 38.23,9.37 37.75,9.37 37.56,9.3 arc-45 37.33,9.21 37.13,9.21 arc-90 ICSP.5
  Bottom 0.178: ICSP.5 33.69,13.21 arc-45 33.62,13.36 33.62,17.08 33.11,17.59 arc-45 32.92,18.04 32.89,18.26 | 32.89,18.26 v32.92,19.49 | v25.43,4.45 26.64,6.25 v26.64,12.29 | v29.43,15.78 30.51,16.48 31.05,16.45 31.34,16.73 32.86,17.49 32.99,17.59 32.89,18.26
RX  (via drill 0.38)
  Top 0.203: FTDI.RXI 41.59,15.4 40.2,14 40.2,12 39.94,11.75 39.94,10.48 v39.05,9.78 | v32.73,10.57 32.89,10.57 33.34,11.02 U1.3
  Bottom 0.203: v39.05,9.78 39.05,8.89 38.16,8 37.59,8 35.88,9.56 35.72,9.68 35.12,9.68 33.81,10.99 33.21,10.99 v32.73,10.57
SAT_CTS  (via drill 0.38)
  Top 0.178: U1.6 33.07,12.52 v32.04,13.34
  Bottom 0.178: v32.04,13.34 27.53,13.34 25.43,15.53 25.43,17.11 26.32,18 26.32,22.92 26.16,23.11 26.16,24.29 25.94,24.51 24.89,24.51 JP3.7
SAT_NA  (via drill 0.38)
  Top 0.178: U1.9 33.35,14.02 v32.48,14.92 | v27.18,24 26.32,24 26,24.38 v26,26.16 26.1,26.23
  Bottom 0.178: v32.48,14.92 27.27,14.92 26.29,15.91 26.29,16.76 26.32,16.8 26.32,16.83 27.21,17.72 27.21,23.56 v27.18,24 | v26,26.16 26.1,27.88 JP3.5
SAT_RI  (via drill 0.38)
  Top 0.178: U1.8 33.03,13.52 v32.19,14.13
  Bottom 0.178: v32.19,14.13 27.46,14.13 25.88,15.72 25.88,16.95 26.8,17.88 26.8,23.08 26.57,23.3 26.61,24.57 27.56,25.53 28.7,25.53 29.05,25.88 29.05,28.23 JP3.4
SAT_RTS  (via drill 0.38)
  Top 0.178: U1.5 32.43,12.02 v32.29,12.16 | v22.57,22.42 22.61,23.21 22.61,27.15 JP3.6
  Bottom 0.178: v32.29,12.16 31.91,12.13 31.15,12.92 27.3,12.92 24.89,15.24 24.89,17.21 25.75,18.07 25.75,20.06 arc63 25.07,21.18 v22.57,22.42
SCK
  Top 0.178: U1.11 34.64,15.02 35.15,14.61 ICSP.3
SCL  (via drill 0.38)
  Top 0.178: MONITOR.P$3 arc90 MONITOR.P$3 | 7.15,27.4 6.19,26.96 5.62,26.99 5.4,26.73 MONITOR.P$3 | MONITOR.P$3
  Top 0.203: U1.25 28.04,18.86 28.57,18.32 28.57,16.51 28.1,16.03 28.13,15.62 27.08,14.61 24.96,14.61 24.42,15.11 24.42,18.45 v23.37,19.43 | v18.51,20.89 18.48,20.89 JP1.3 JP8.3 JP3.9 | 7.15,27.4 9.49,27.4 10.51,26.86 12,26.86 v12.16,26.8
  Bottom 0.203: v23.37,19.43 23.37,19.72 22.57,20.52 arc45 21.67,20.89 v18.51,20.89 | JP1.3 14.67,21.84 12.92,21.84 12.48,22.1 12.48,24.61 12.38,24.8 12.38,26.38 v12.16,26.8
SDA  (via drill 0.38)
  Top 0.178: MONITOR.P$4 4.9,25.9 4.89,26.42 4.89,27.37 4.76,27.5 4.76,29.34 5.08,29.88 11.37,29.88 12.35,28.89 12.35,27.62 12.86,27.11 14.57,27.11 v14.48,27.15
  Top 0.203: JP3.8 JP8.2 JP1.2 | U1.26 27.54,18.53 27.65,18.41 27.78,18.41 28.1,18.1 28.1,16.7 27.62,16.22 27.65,15.84 26.96,15.14 25.21,15.14 24.99,15.37 24.99,17.53 25.27,17.91 25.27,18.32 v25.11,18.48
  Bottom 0.178: v14.48,27.15 14.67,27.11 arc90 15.02,26.89 17.68,26.89 arc90 18.07,27.27 18.07,28.1 arc-90 18.35,28.38 JP3.8
  Bottom 0.203: v25.11,18.48 24.96,18.51 24.57,18.89 24.57,19.88 23.07,21.38 arc45 22.18,21.75 20.69,21.75 arc-45 19.79,22.12 JP1.2
SEL  (via drill 0.38)
  Top 0.178: IC1.P$3 4.08,15.06 v4.03,15.11 | Q3.3 17.38,20.35 v17.46,19.62 16.53,19.63 R_MOS1.1
  Bottom 0.178: v4.03,15.11 3.87,15.37 3.56,15.56 3.37,15.97 3.37,19.37 3.62,19.62 6.32,19.62 6.67,19.94 6.76,20.03 7.14,20.45 9.3,20.45 10.35,20.23 10.57,19.91 11.56,18.76 13.62,18.8 14.64,19.21 16.67,19.56 17.02,19.53 v17.46,19.62
SER_FROM_SAT  (via drill 0.38)
  Top 0.178: U1.27 27.04,17.67 v27.4,16.99
  Bottom 0.178: v27.4,16.99 27.56,17.27 27.75,17.62 27.75,23.11 28.35,23.72 28.35,24.54 29.56,25.75 31.34,25.75 JP3.2
SER_TO_SAT  (via drill 0.38)
  Top 0.178: U1.28 26.54,16.71 v27.02,16.22
  Bottom 0.178: v27.02,16.22 27.53,16.22 28.29,16.99 28.29,22.99 28.86,23.59 28.86,24.32 28.96,24.38 28.96,24.48 29.81,25.34 31.59,25.34 33.15,26.89 35.27,26.89 JP3.1
SLEEP  (via drill 0.38)
  Top 0.178: U1.16 v34.07,17.91 | v29.53,23.65 29.08,23.18 27.88,23.18 27.5,23.4 26.42,23.4 v25.53,23.91
  Bottom 0.178: v34.07,17.91 33.59,18.13 33.4,18.32 33.4,19.05 33.62,19.27 33.62,19.75 33.24,20.13 32.67,20.13 31.72,18.95 31.72,18.45 31.24,17.94 31.02,17.97 30.92,17.88 30.73,17.88 29.94,18.67 29.94,19.78 28.7,21.02 28.7,22.8 29.4,23.46 v29.53,23.65 | JP8.1 23.69,25.18 24.83,24 24.92,23.91 v25.53,23.91
STAT1  (via drill 0.38)
  Top 0.178: 6.76,12.12 6.68,12.04 CHRG/LBO.C | IC1.P$8 6.76,12.01 | 6.76,12.01 CHRG/LBO.C | 6.76,12.01 6.76,11.96 6.67,11.87 | v6.95,11.87 6.92,11.96 CHRG/LBO.C | U1.47 21.82,10.52 21.4,10.1 21.4,9.18 21.05,8.83 12.61,8.83 12.22,9.21 11.65,9.21 11.37,8.83 11.08,8.41 v11.08,8.45
  Bottom 0.178: v11.08,8.45 8.48,8.45 6.79,10.1 6.79,11.91 v6.95,11.87
STAT2  (via drill 0.38)
  Top 0.178: 5.74,11.84 DONE.C | IC1.P$7 6.26,12.8 6.16,12.48 5.84,12.28 DONE.C | v5.46,11.87 5.65,11.87 DONE.C | U1.48 22.54,9.01 21.97,8.45 12.29,8.45 v12.26,8.32 12.22,8.38
  Bottom 0.178: v12.26,8.32 12.13,8.1 11.91,7.81 8.54,7.81 5.62,10.7 5.62,11.81 v5.46,11.87
TCK  (via drill 0.38)
  Top 0.203: TC1.1 39.18,5.82 39.18,6.1 v38.1,7.08 | v28.99,9.59 28.83,9.59 28.54,9.3 U1.57
  Bottom 0.203: v38.1,7.08 37.4,7.46 36.67,8.26 36.13,8.64 35.08,8.64 34.48,9.14 32.92,9.14 32.77,9.4 32.67,9.65 31.97,9.14 31.75,8.92 29.62,8.92 28.96,9.59 v28.99,9.59
TDI  (via drill 0.38)
  Top 0.178: U1.54 27.04,6.14 v27.4,5.56 | v29.88,3.65 30.45,2.92 v31.34,1.49 | v38.54,2.35 TC1.9
  Bottom 0.178: v27.4,5.56 27.4,5.14 v29.88,3.65 | v31.34,1.49 31.4,0.95 31.91,0.45 36.64,0.45 v38.54,2.35
TDO  (via drill 0.38)
  Top 0.178: U1.55 27.54,6.63 27.88,6.29 28.07,6.29 v28.1,6.16 | v37.78,5.91 TC1.3
  Bottom 0.178: v28.1,6.16 32.64,6.16 32.92,6.45 33.81,6.45 34.8,5.46 36.51,5.46 v37.78,5.91
THE_HEAT_ON
  Top 0.178: U1.45 23.24,11.52 23.37,11.65 23.37,17.75 23.05,18.07 23.05,18.54 22.77,18.83 22.77,21.65 23.24,22.16 23.24,22.73 23.02,23.02 23.02,26.67 23.27,26.92 25.84,26.92 25.97,26.86 28.29,26.86 28.83,26.51 29.45,26.51 Q2.1 30.17,25.84 Q1.1
THERM_ANALOG  (via drill 0.38, 0.8)
  Top 0.178: MONITOR.P$2 5.94,25.54 5.97,26.38 7.11,26.92 8.29,26.92 8.6,26.73 C_BM3.1 9.84,24.92 | 9.72,25.08 9.59,25.21 9.84,24.92 | 21.46,16.76 v21.43,16.73 21.34,16.76 19.65,16.76 18.64,15.75 v18.48,15.75 18.25,15.75 THMST_BM.1 | v13.31,19.98 12.41,20.64 11.11,20.65 9.87,21.91 9.91,22.51 9.91,24.86 9.84,24.92
  Top 0.203: U1.61 30.54,9.93 v30.57,9.97 | v30.61,11.62 30.57,11.68 30.29,11.59 24.86,11.59 v24.67,11.94 | R_BM1.1 v13.31,19.98 | v16.48,20.77 15.84,20.77 15.62,20.54 15.62,18.99 15.91,18.76 21.02,18.76 21.46,18.35 21.46,16.76
  Bottom 0.178: 21.46,12.35 21.88,11.94 v24.67,11.94
  Bottom 0.203: v30.57,9.97 v30.61,11.62 | 21.46,12.35 21.46,14.86 21.43,16.22 v21.43,16.73 | v13.31,19.98 14.54,20.19 15.65,20.51 v16.48,20.77
TMS  (via drill 0.38)
  Top 0.178: TC1.5 34.74,5.52 33.72,6.54 33.72,6.76 33.27,7.21 33.27,7.18 33.24,7.14 v32.99,7.14 | v28.16,7.02 arc-90 28.04,7.14 U1.56
  Bottom 0.178: v32.99,7.14 28.29,7.14 v28.16,7.02
TX  (via drill 0.38)
  Top 0.178: v37.21,9.94 37.21,12.51 37.5,12.76 39.37,12.76 39.75,13.14 39.75,15.68 40.23,16.16 40.23,16.73 FTDI.TXO
  Top 0.203: U1.2 34.66,10.52 35.21,9.97 35.97,9.24 36.16,9.11 36.39,8.95 36.51,8.86 36.67,8.76 37.05,8.64 v37.91,8.64
  Bottom 0.203: v37.91,8.64 37.85,9.4 v37.21,9.94
VCC  (via drill 0.38)
  Top 0.178: C3.1 3.47,10.45 3.49,10.48 | IC1.P$4 4.24,14.56 3.87,14.19 1.52,14.19 R_CH1.2 | IC1.P$9 7.26,12.71 7.53,12.26
  Top 0.254: 9.42,6.99 R_LED2.2 | 9.38,2.08 R_LED3.2
  Top 0.813: 35.37,18.86 D1.C 35.43,18.86 v35.56,18.73 | v10.48,5.46 10.77,5.08 C4.+
  Bottom 0.508: 34.13,4.54 32.89,4.54
  Bottom 0.61: 32.89,4.54 32.23,4.1
  Bottom 0.711: 38.45,4.54 34.13,4.54
  Bottom 0.762: 40.07,17.37 40.07,8.89
  Bottom 0.813: v35.56,18.73 35.85,18.73 36.39,18.19 39.27,18.19 40.07,17.37 | 40.07,8.89 39.05,7.75 39.05,4.76 38.45,4.54 | 32.23,4.1 30.42,2.73 28.73,2.03 23.91,2.06 19.97,4.76 19.05,5.46 v10.48,5.46
  pour Top (isolate 0.203): 14.64,6.94 12.64,6.92 11.78,7.78 11.78,12.03 10.73,13.08 10.73,20.57 10.22,20.38 10.16,20.26 0.13,20.22 0,0.38 2.87,0.38 14.69,0.38
VPCC
  Top 0.178: R_CH1.1 1.37,16.3 R_CH2.1 1.84,17.06 1.84,17.3 2.06,17.53 3.65,17.53 3.9,17.27 3.9,16 4.13,15.78 arc45 4.58,15.59 IC1.P$2
(copper drawn outside any net)
  shapes: Bottom circle x1, Top circle x1

### Text on the board
Top: - | + | 1 | 1 | 1 | gr | 1 | + | -
Bottom: 2012 | pcb: | raphaelabrams.com | BCP-U 1.0 CC-BY | dan@balloonconsulting.com
tNames: a1
tValues: 1k | 1k